# EAGLE design ns2012 (EAGLE 6.5.0)
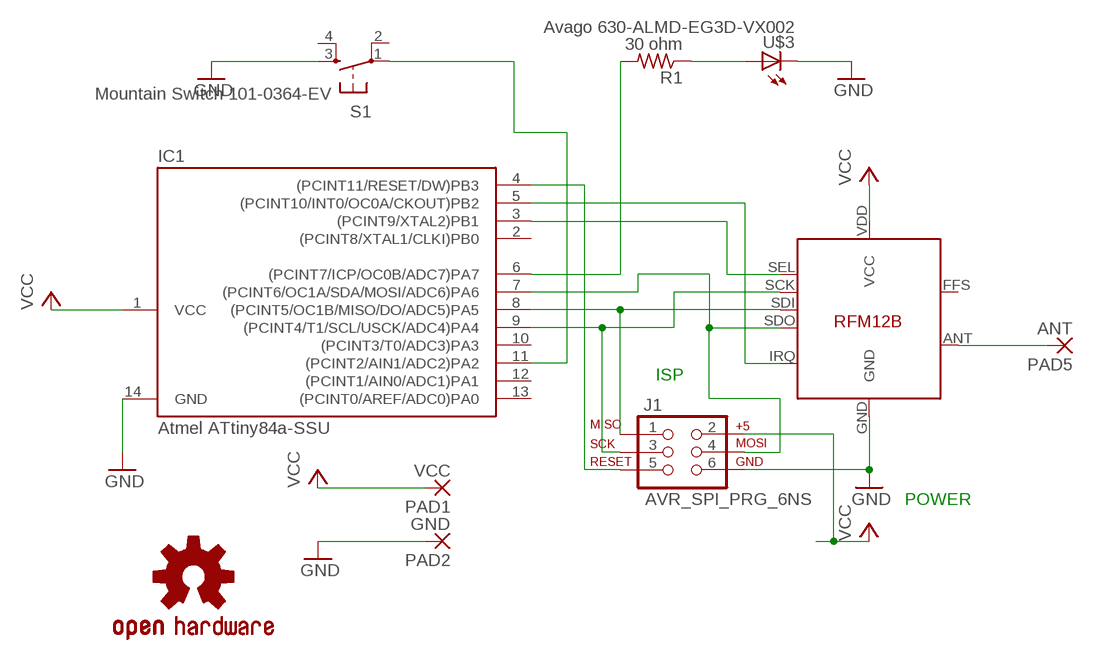
[diagram p0: schematic, sheet 1]

## Parts
IC1  Atmel ATtiny84a-SSU  TINY24/44/84-SSU  [SOIC14]
J1  AVR_SPI_PRG_6NS  [2X3-NS]
PAD1  VCC  2,15/1,0  [2,15/1,0]
PAD2  GND  2,15/1,0  [2,15/1,0]
PAD5  ANT  2,15/1,0  [2,15/1,0]
R1  30 ohm  R-US_R0805  [R0805]
RFM12B  HopeRF RFM12B-433S1  RFM12BN  [RFM12B-NARROW]
S1  Mountain Switch 101-0364-EV  DTSM-6  [DTSM-6]
U$1  OSHW-LOGOS  [OSHW-LOGO-S]
U$3  Avago 630-ALMD-EG3D-VX002  ALMD-XX3D  [ALMD-**3D]

## Nets
GND: IC1.14(GND) J1.6 PAD2.1(P) RFM12B.GND S1.3 U$3.C1(C) U$3.C2(C)
N$1: R1.1 U$3.A1(A) U$3.A2(A)
N$2: IC1.9((PCINT4/T1/SCL/USCK/ADC4)PA4) J1.3 RFM12B.SCK
N$3: IC1.8((PCINT5/OC1B/MISO/DO/ADC5)PA5) J1.1 RFM12B.SDI
N$4: IC1.7((PCINT6/OC1A/SDA/MOSI/ADC6)PA6) J1.4 RFM12B.SDO
N$5: IC1.3((PCINT9/XTAL2)PB1) RFM12B.SEL
N$6: IC1.6((PCINT7/ICP/OC0B/ADC7)PA7) R1.2
N$7: IC1.5((PCINT10/INT0/OC0A/CKOUT)PB2) RFM12B.IRQ
N$8: PAD5.1(P) RFM12B.ANT
N$10: IC1.11((PCINT2/AIN1/ADC2)PA2) S1.1
N$14: IC1.4((PCINT11/RESET/DW)PB3) J1.5
VCC: IC1.1(VCC) J1.2 PAD1.1(P) RFM12B.VDD(VCC)
Unconnected: IC1.2((PCINT8/XTAL1/CLKI)PB0) IC1.10((PCINT3/T0/ADC3)PA3) IC1.12((PCINT1/AIN0/ADC1)PA1) IC1.13((PCINT0/AREF/ADC0)PA0) RFM12B.FFS S1.2 S1.4

## Notes on the sheet
- ISP
- POWER

## Library data of the parts
IC1 = avr-7:TINY24/44/84
J1 = SparkFun-Connectors:AVR_SPI_PRG_6: AVR ISP 6 Pin This is the reduced ISP connector for AVR programming. Common on Arduino. This footprint will take up less PCB space and can be used with a 10-pin to 6-pin adapter such as SKU: BOB-08508
PAD1 PAD2 PAD5 = wirepad:2,15/1,0: THROUGH-HOLE PAD
R1 = resistor:R-US_: RESISTOR, American symbol
RFM12B = JeeLabs:RFM12B
S1 = switch-tact:DTSM-6
U$1 = sfe-aesthetics:OSHW-LOGO: Open Source Hardware Logo This logo indicates the piece of hardware it is found on incorporates a OSHW license and/or adheres to the definition of open source hardware found here: http://freedomdefined.org/OSHW
U$3 = ALMD-XX3D:ALMD-XX3D

## Board
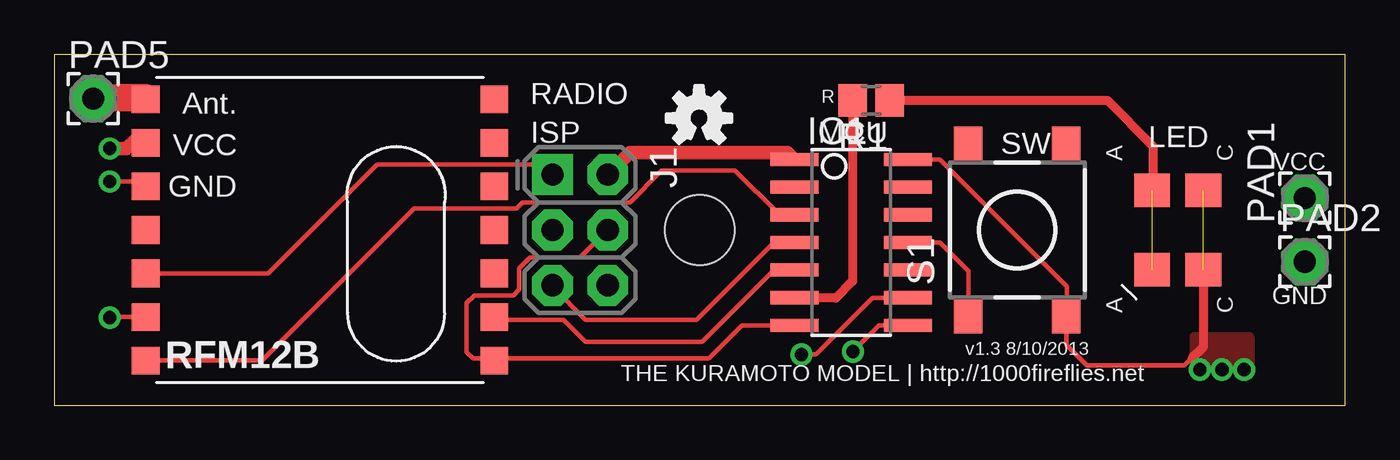
[diagram p1: board, top side]
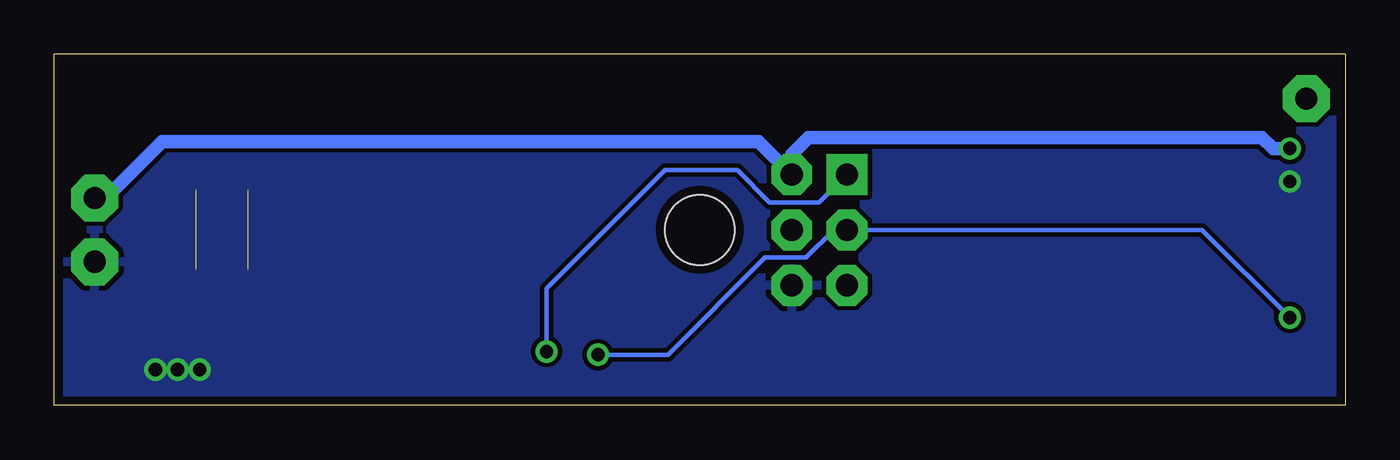
[diagram p2: board, bottom side, seen from below]

Size 59.25 x 16.13 mm. Coordinates in mm from the lower left corner, seen from the top.
Outline: 0,0 59.24,0 59.24,16.13 0,16.13 0,0
Copper layers (1*16): Top 0.035mm / dielectric 1.5mm / Bottom 0.035mm
Design rules "default": minimum track width 8mil, minimum drill 24mil, track to track 8mil, track to pad 8mil, pad to pad 8mil, via to via 8mil, smd to smd 8mil, copper to edge 16mil, drill to drill 8mil, minimum pad ring 10mil, minimum via ring 8mil, stop-mask expansion 4mil, vias tented up to drill 0mil, thermal gap 10mil
Holes 3.2 mm at 29.62,8.06
tKeepout: area 0,0 to 35.6,3.3; area 0,30 to 35.6,33.3
vRestrict: area 9.4,0.8 to 25.1,15

### Footprints (pad centres in the part's own frame; a part is rotated, then mirrored left to right if it is on the bottom)
SOIC14 = smd 0.61 x 2.21: 1 -3.81,-2.603; 2 -2.54,-2.603; 3 -1.27,-2.603; 4 0,-2.603; 5 1.27,-2.603; 6 2.54,-2.603; 7 3.81,-2.603; 8 3.81,2.603; 9 2.54,2.603; 10 1.27,2.603; 11 0,2.603; 12 -1.27,2.603; 13 -2.54,2.603; 14 -3.81,2.603
2X3-NS = drill 1.016 pad 1.88 square: 1 -2.54,-1.27 | drill 1.016 pad 1.88 octagon: 2 -2.54,1.27; 3 0,-1.27; 4 0,1.27; 5 2.54,-1.27; 6 2.54,1.27
2,15/1,0 = drill 1.016 pad 2.159 octagon: 1 0,0
R0805 = smd 1.3 x 1.5: 1 -0.85,0; 2 0.85,0
RFM12B-NARROW = smd 1.27 x 1.27: ANT 8,-6; FFS -8,2; GND 8,-2; IRQ -8,4; P$8 -8,0; P$9 -8,-2; P$10 -8,-4; P$12 -8,-6; P$16 8,0; SCK 8,4; SDI 8,2; SDO -8,6; SEL 8,6; VDD 8,-4
DTSM-6 = smd 1.55 x 1.3: 1 -3.975,2.25; 2 3.975,2.25; 3 -3.975,-2.25; 4 3.975,-2.25
ALMD-**3D = smd 1.55 x 1.65: A1 -1.825,1.175; A2 1.825,1.175; C1 -1.825,-1.175; C2 1.825,-1.175

### Placement (x,y rotation side)
IC1  36.58,7.49 270 top
J1  24.13,8.06 270 top
PAD1  57.4,9.53 90 top
PAD2  57.4,6.6 0 top
PAD5  1.78,14.1 0 top
R1  37.49,14.02 180 top
RFM12B  12.19,8.06 180 top
S1  44.2,8.06 90 top
U$1  29.59,13.21 0 top
U$3  51.56,8.06 90 top

### Tracks (layer width: path | path; a pad name or v marks a point on that pad's centre or on a via)
GND  (via drill 0.61)  (1 unrouted)
  Top 0.203: 4.37,10.29 RFM12B.GND 4.16,10.29 v2.54,10.29 2.57,10.26 | v52.58,1.65 52.22,2.16 52.18,2.16 51.87,1.84 47.4,1.84 46.45,2.79 S1.3 46.48,4.38 46.48,5.46 40.64,11.3 IC1.14
  Top 0.406: U$3.C1 52.74,2.67 52.22,2.16
  other vias: 54.61,1.65 53.59,1.65
  pour Bottom: -0.51,-0.51 59.69,-0.51 59.69,16.51 -0.25,16.26
  pour Top (no thermals): 54.86,1.65 52.32,1.65 52.32,3.17 54.86,3.17
N$1  (1 unrouted)
  Top 0.406: R1.1 48.32,14.02 50.42,11.93 50.42,9.92 U$3.A2
N$2  (via drill 0.61)
  Top 0.203: 4.17,4.39 RFM12B.SCK 2.57,4.06 v2.54,4.04 | IC1.9 37.55,4.95 34.95,2.35 34.3,2.35 v34.29,2.34
  Bottom 0.203: v34.29,2.34 31.08,2.34 26.64,6.77 26.64,6.79 24.74,6.79 23.47,8.06 J1.3 6.57,8.06 v2.54,4.04
N$3  (via drill 0.61)
  Top 0.203: RFM12B.SDI 9.81,6.06 14.81,11.06 22.4,11.06 J1.1 | IC1.8 37.86,3.68 v36.65,2.48
  Bottom 0.203: J1.1 22.89,10.6 24.16,9.34 26.42,9.34 27.89,10.81 31.22,10.81 36.65,5.37 v36.65,2.48
N$4
  Top 0.203: 20.22,2.16 RFM12B.SDO | IC1.7 31.57,3.68 30.05,2.16 20.22,2.16 | J1.4 24.13,6.79 21.84,6.79 21.34,6.29 21.34,5.33 21.07,5.07 19.28,5.07 18.92,4.71 18.92,2.45 19.21,2.16 20.22,2.16
N$5
  Top 0.203: IC1.3 33.27,8.76 31.24,10.79 27.88,10.79 26.42,9.34 21.49,9.34 21.21,9.05 16.52,9.05 9.53,2.06 RFM12B.SEL
N$6
  Top 0.406: R1.2 36.64,5.72 35.87,4.94 33.98,4.94 IC1.6
N$7
  Top 0.203: IC1.5 33.02,6.22 29.72,2.92 24.38,2.92 23.37,3.94 20.32,3.94 RFM12B.IRQ
N$8
  Top 0.203: 4.17,14.15 RFM12B.ANT
  Top 1.27: 4.17,14.15 2.95,14.15 PAD5.1
N$10
  Top 0.203: S1.1 41.95,6.19 40.64,7.49 IC1.11
N$14
  Top 0.203: IC1.4 33.02,7.49 29.46,3.94 24.38,3.94 22.86,5.46 J1.5
VCC  (via drill 0.61)
  Top 0.203: 4.37,12.32 RFM12B.VDD
  Top 0.61: RFM12B.VDD 4.13,12.32 3.81,12.32 3.3,11.81 v2.54,11.81 | 25.41,10.6 J1.2 26.42,11.62 33.66,11.62 IC1.1
  Bottom 0.61: v2.54,11.81 3.3,11.81 3.81,12.32 24.64,12.32 25.4,11.56 J1.2 25.41,10.6 26.92,12.12 54.3,12.12 56.9,9.53 PAD1.1

### Text on the board
tPlace: RADIO | R | ISP | MCU | SW | LED | VCC | GND | v1.3 8/10/2013 | THE KURAMOTO MODEL | http://1000fireflies.net